# Altium schematic sheet sch.SchDoc
size A4
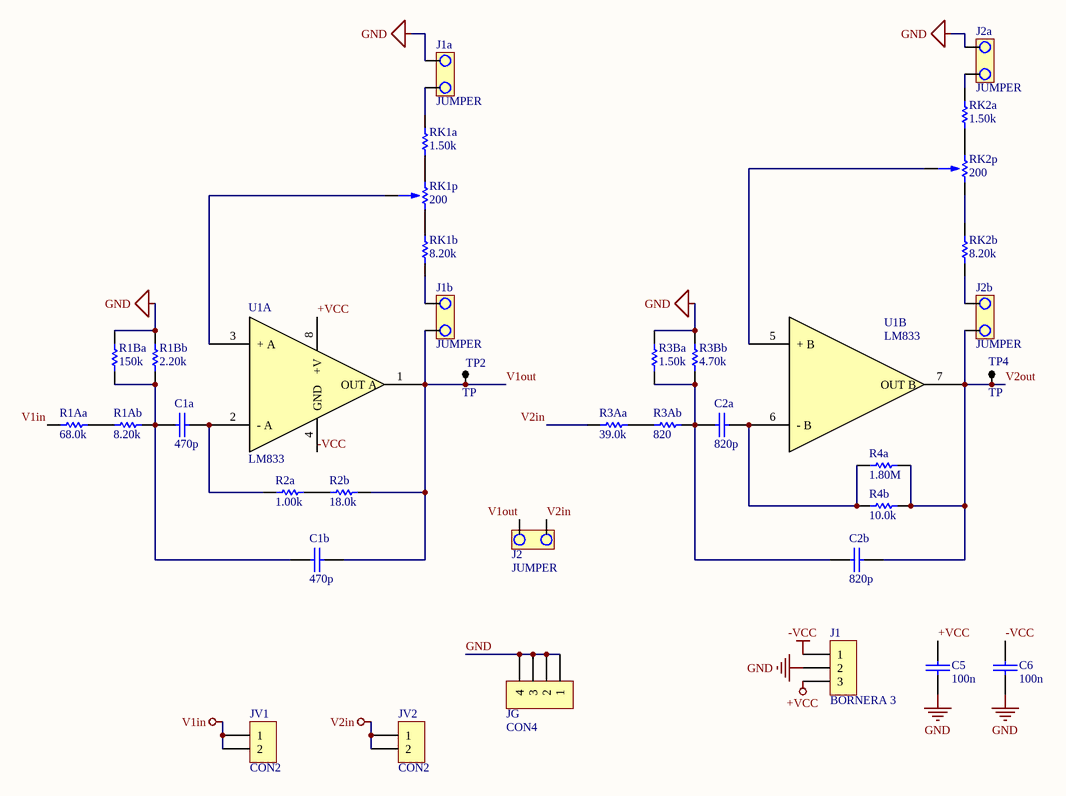
[diagram p0: sch.SchDoc]

## Parts
C1a  470p  [CAP100]
C1b  470p  [CAP100]
C2a  820p  [CAP100]
C2b  820p  [CAP100]
C5  100n  [CAP100]
C6  100n  [CAP200]
J1  BORNERA 3  [BORNERA3]
J1a  JUMPER  [JUMPER2]
J1b  JUMPER  [JUMPER2]
J2  JUMPER  [JUMPER2]
J2a  JUMPER  [JUMPER2]
J2b  JUMPER  [JUMPER2]
JG  CON4  [SIP4]
JV1  CON2  [SIP2]
JV2  CON2  [SIP2]
R1Aa  68.0k  [0805]
R1Ab  8.20k  [0805]
R1Ba  150k  [0805]
R1Bb  2.20k  [0805]
R2a  1.00k  [0805]
R2b  18.0k  [0805]
R3Aa  39.0k  [0805]
R3Ab  820  [0805]
R3Ba  1.50k  [0805]
R3Bb  4.70k  [0805]
R4a  1.80M  [RES500]
R4b  10.0k  [0805]
RK1a  1.50k  [0805]
RK1b  8.20k  [0805]
RK1p  200  [PRESET V]
RK2a  1.50k  [0805]
RK2b  8.20k  [0805]
RK2p  200  [PRESET V]
TP2  TP  [TPTH]
TP4  TP  [TPTH]
U1  LM833  [DIP8]  (parts A,B of 2)

## Nets
+VCC: C5.1 J1.3 U1.8(+V)
-VCC: C6.1 J1.1 U1.4(GND)
GND: C5.2 C6.2 J1.2 J1a.2 J2a.2 JG.1 JG.2 JG.3 JG.4 R1Ba.1 R1Bb.1 R3Ba.1 R3Bb.1
V1in: JV1.1 JV1.2 R1Aa.1
V2in: J2.2 JV2.1 JV2.2 R3Aa.1
V1out: C1b.1 J1b.1 J2.1 R2b.2 TP2.1 U1.1(OUT_A)
V2out: C2b.1 J2b.1 R4a.2 R4b.2 TP4.1 U1.7(OUT_B)
NetC1a_1: C1a.1 R2a.1 U1.2(-_A)
NetC1a_2: C1a.2 C1b.2 R1Ab.2 R1Ba.2 R1Bb.2
NetC2a_1: C2a.1 R4a.1 R4b.1 U1.6(-_B)
NetC2a_2: C2a.2 C2b.2 R3Ab.2 R3Ba.2 R3Bb.2
NetJ1a_1: J1a.1 RK1a.1
NetJ1b_2: J1b.2 RK1b.2
NetJ2a_1: J2a.1 RK2a.1
NetJ2b_2: J2b.2 RK2b.2
NetR1Aa_2: R1Aa.2 R1Ab.1
NetR2a_2: R2a.2 R2b.1
NetR3Aa_2: R3Aa.2 R3Ab.1
NetRK1a_2: RK1a.2 RK1p.3
NetRK1b_1: RK1b.1 RK1p.1
NetRK1p_2: RK1p.2 U1.3(+_A)
NetRK2a_2: RK2a.2 RK2p.3
NetRK2b_1: RK2b.1 RK2p.1
NetRK2p_2: RK2p.2 U1.5(+_B)

## Library data of the parts
C1a C1b C2a C2b C5 C6 = CAP
R1Aa R1Ab R1Ba R1Bb R2a R2b R3Aa R3Ab R3Ba R3Bb R4a R4b RK1a RK1b RK2a RK2b = RES
RK1p RK2p = PRESET
U1 = LM833: Dual Audio Operational Amplifier